# EAGLE design WMF Ambient SmartPot_A (EAGLE 9.5.1)
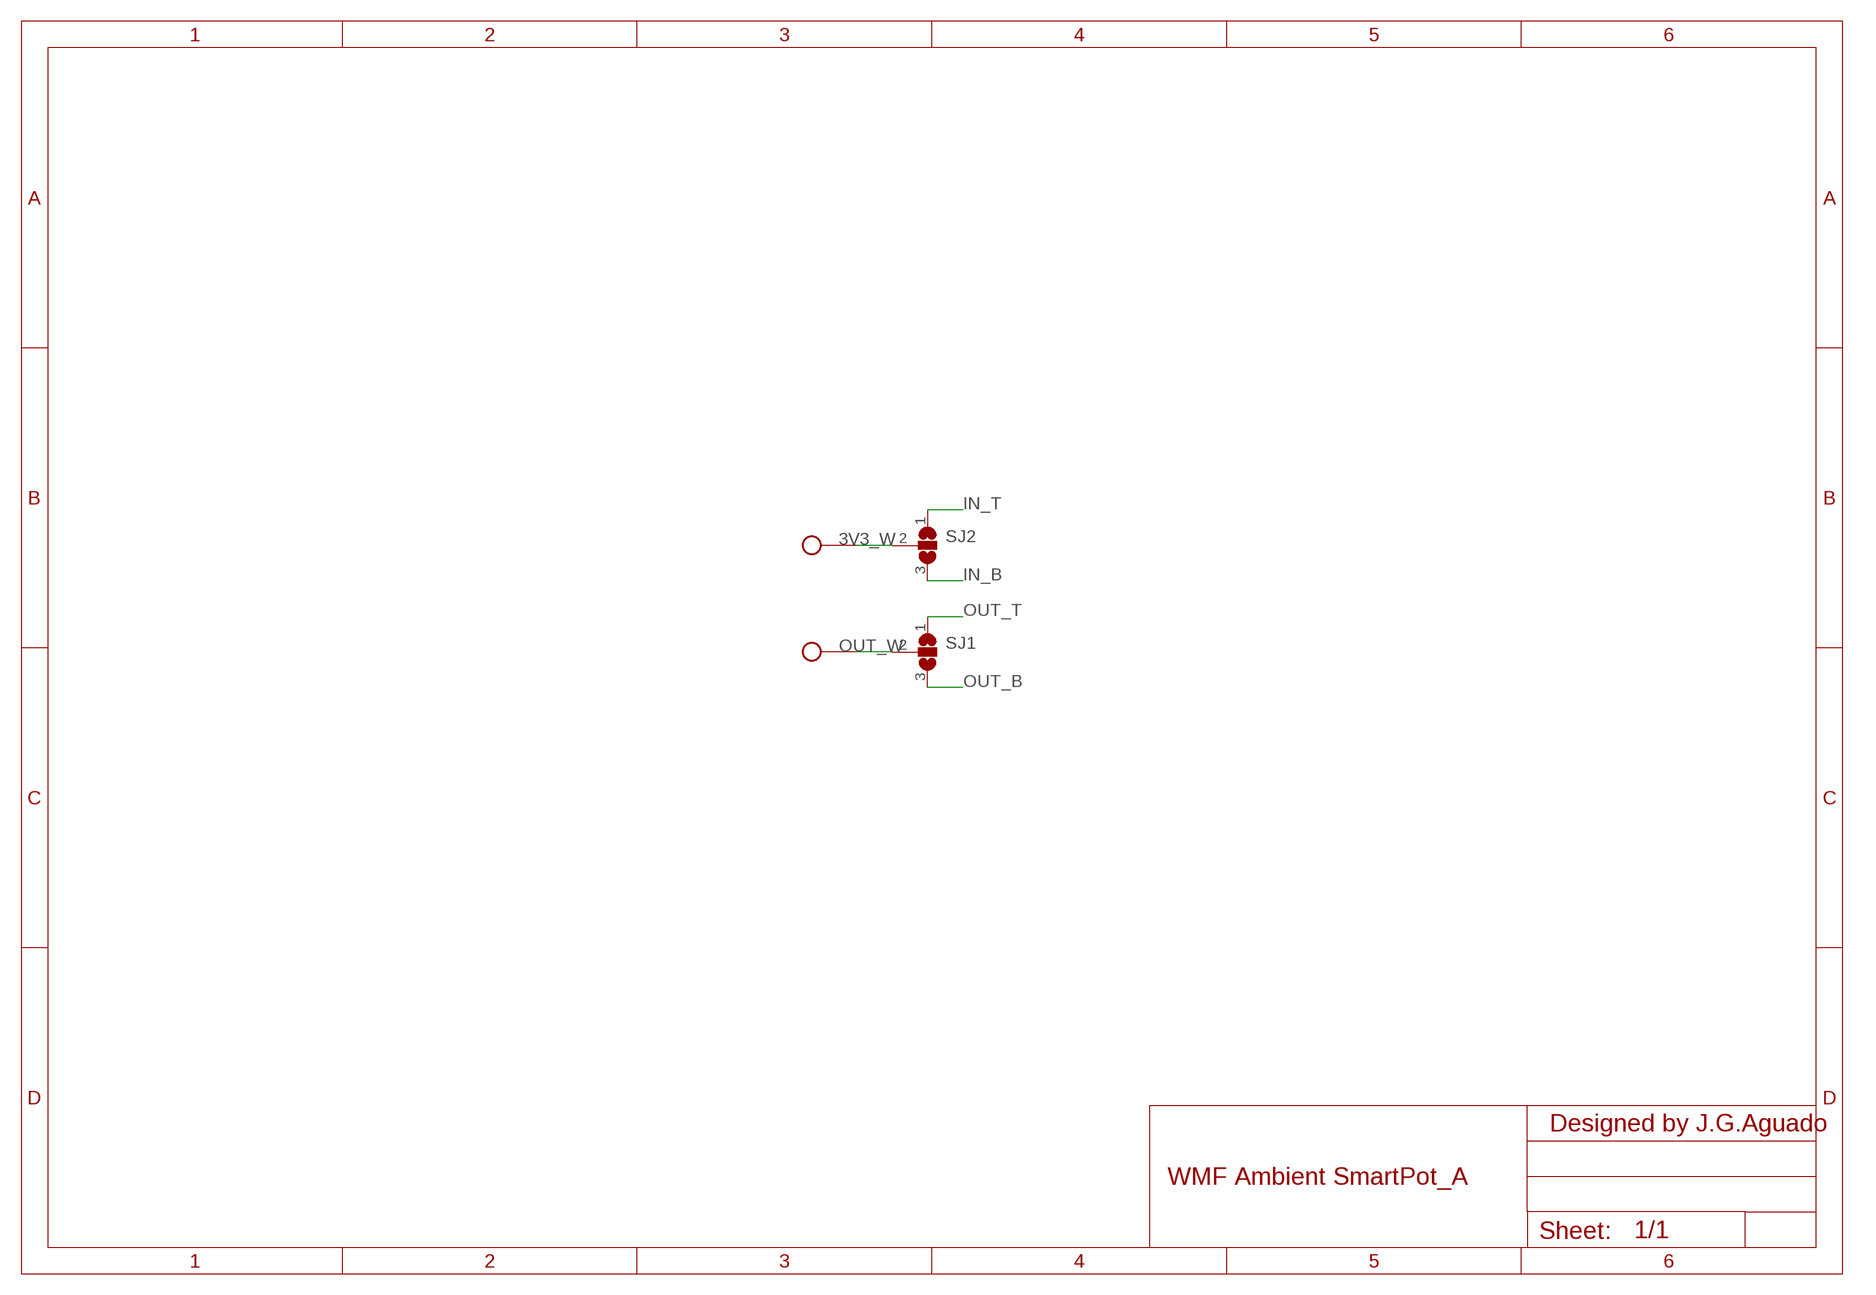
[diagram p0: schematic, sheet 1]

## Parts
SJ1  SJ2W  [SJ_2]
SJ2  SJ2W  [SJ_2]
U$4  OVAL_3MM_HOLE  [OVAL_HOLE]
U$5  OVAL_3MM_HOLE  [OVAL_HOLE]

## Nets
3V3_W: SJ2.2 U$4.P$2
IN_B: SJ2.3
IN_T: SJ2.1
OUT_B: SJ1.3
OUT_T: SJ1.1
OUT_W: SJ1.2 U$5.P$2

## Notes on the sheet
- Designed by J.G.Aguado

## Library data of the parts
SJ1 SJ2 = jumper:SJ2W: SMD solder JUMPER
U$4 U$5 = SpaceDIY_connectors:OVAL_3MM_HOLE

## Board
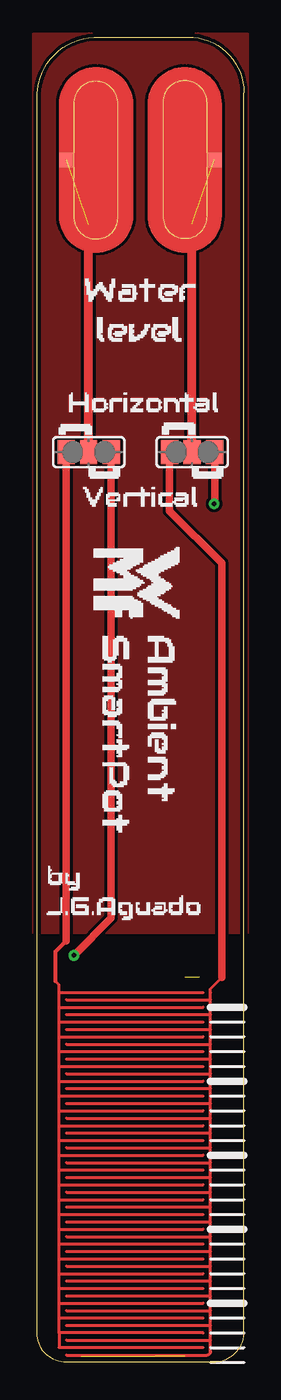
[diagram p1: board, top side]
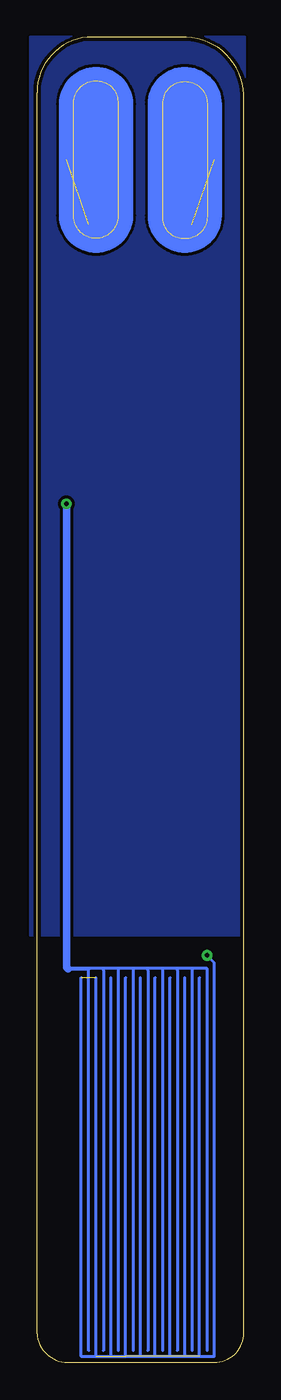
[diagram p2: board, bottom side, seen from below]

Size 14 x 89.55 mm. Coordinates in mm from the lower left corner, seen from the top.
Outline: 0,2 0,85.68 arc-90 4.25,89.55 10.25,89.55 arc-90 14,85.8 14,1.95 arc-90 11.75,0 2,0 arc-90 0,2
Copper layers (1*16): Top 0.035mm / dielectric 1.5mm / Bottom 0.035mm
Design rules "PCBway *": minimum track width 6mil, minimum drill 0.3mm, track to track 0.205mm, track to pad 0.205mm, pad to pad 0.205mm, via to via 0.205mm, smd to smd 8mil, copper to edge 10mil, drill to drill 8mil, minimum pad ring 10mil, minimum via ring 8mil, stop-mask expansion 4mil, vias tented up to drill 25mil, thermal gap 10mil

### Footprints (pad centres in the part's own frame; a part is rotated, then mirrored left to right if it is on the bottom)
SJ_2 = smd 1.168 x 1.6: 1 -1.524,0; 2 0,0; 3 1.524,0
OVAL_HOLE = smd 1 x 1: P$2 -2,0

### Placement (x,y rotation side)
SJ1  10.5,61.5 0 top
SJ2  3.5,61.5 0 top
U$4  4,81.25 0 top
U$5  10,81.25 180 top

### Tracks (layer width: path | path; a pad name or v marks a point on that pad's centre or on a via)
3V3_W  (1 unrouted)
  Top 0.61: SJ2.2 3.5,76.88
CAP
  pour Top: 11.75,0.75 arc-90 11.5,0.5
GND
  pour Top: -0.25,89.8 14.25,89.8 14.25,29 -0.25,29
  pour Bottom: 14.45,89.6 -0.05,89.6 -0.05,28.8 14.45,28.8
IN_B  (via drill 0.3)  (8 unrouted)
  Top 0.508: SJ2.3 5.02,30.03 v2.5,27.5
  Bottom 0.203: 3,0.4 3,26 | 4,0.4 4,26 | 5,0.4 5,26 | 6,0.4 6,26 | 7,0.4 7,26 | 8,0.4 8,26 | 9,0.4 9,26 | 10,0.4 10,26 | 11,26 11,0.4 2,0.4 2,27 v2.5,27.5
IN_T
  Top 0.2: 11.25,2 1.5,2 | 1.5,2 1.5,3 | 1.5,3 11.25,3 | 1.5,3 1.5,4 | 1.5,4 1.5,5 | 1.5,5 1.5,6 | 1.5,6 1.5,7 | 1.5,7 1.5,8 | 1.5,8 1.5,9 | 1.5,4 11.25,4 | 1.5,2 1.5,1 11.25,1 | 1.5,5 11.25,5 | 1.5,6 11.25,6 | 1.5,7 11.25,7 | 1.5,8 11.25,8 | 1.5,9 11.25,9 | 1.5,9 1.5,10 | 1.5,10 1.5,11 | 1.5,11 1.5,12 | 1.5,12 1.5,13 | 1.5,13 1.5,14 | 1.5,10 11.25,10 | 1.5,11 11.25,11 | 1.5,12 11.25,12 | 1.5,13 11.25,13 | 1.5,14 11.25,14 | 1.5,14 1.5,15 | 1.5,15 1.5,16 | 1.5,16 1.5,17 | 1.5,17 1.5,18 | 1.5,18 1.5,19 | 1.5,15 11.25,15 | 1.5,16 11.25,16 | 1.5,17 11.25,17 | 1.5,18 11.25,18 | 1.5,19 11.25,19 | 1.5,19 1.5,20 | 1.5,20 1.5,21 | 1.5,21 1.5,22 | 1.5,22 1.5,23 | 1.5,23 1.5,24 | 1.5,24 1.5,25 | 1.5,25 1.5,25.25 | 1.5,20 11.25,20 | 1.5,21 11.25,21 | 1.5,22 11.25,22 | 1.5,23 11.25,23 | 1.5,24 11.25,24 | 1.5,25 11.25,25
  Top 0.203: 1.5,25.25 1.5,25.5 1.24,25.77
  Top 0.254: 1.98,28.48 1.24,27.74 1.24,25.77
  Top 0.508: SJ2.1 1.98,28.48
N$19
  Bottom 0.203: 3.5,26.5 3.5,0.8
N$22
  Bottom 0.203: 4.5,26.5 4.5,0.8
N$24
  Bottom 0.203: 5.5,26.5 5.5,0.8
N$26
  Bottom 0.203: 6.5,26.5 6.5,0.8
N$28
  Bottom 0.203: 7.5,26.5 7.5,0.8
N$30
  Bottom 0.203: 8.5,26.5 8.5,0.8
N$32
  Bottom 0.203: 9.5,26.5 9.5,0.8
OUT_B  (via drill 0.3)
  Top 0.508: SJ1.3 12.02,58.03 v12,58
  Bottom 0.203: 2.5,0.8 2.5,26.62 10.5,26.62 10.5,26.6 10.5,0.8
  Bottom 0.254: 10.5,26.6 11.9,26.6
  Bottom 0.508: 11.9,26.6 12,26.7 v12,58
OUT_T
  Top 0.2: 11.75,3.5 11.75,4.5 | 11.75,4.5 11.75,5.5 | 11.75,5.5 11.75,6.5 | 11.75,6.5 11.75,7.5 | 11.75,7.5 11.75,8.5 | 11.75,8.5 11.75,9.5 | 11.75,9.5 11.75,10.5 | 2,3.5 11.75,3.5 | 2,0.5 11.5,0.5 arc90 11.75,0.75 11.75,1.5 | 2,2.5 11.75,2.5 | 11.75,2.5 11.75,3.5 | 11.75,1.5 11.75,2.5 | 2,1.5 11.75,1.5 | 2,4.5 11.75,4.5 | 2,5.5 11.75,5.5 | 2,6.5 11.75,6.5 | 2,7.5 11.75,7.5 | 2,8.5 11.75,8.5 | 2,9.5 11.75,9.5 | 11.75,10.5 11.75,11.5 | 11.75,11.5 11.75,12.5 | 11.75,12.5 11.75,13.5 | 11.75,13.5 11.75,14.5 | 11.75,14.5 11.75,15.5 | 2,10.5 11.75,10.5 | 2,11.5 11.75,11.5 | 2,12.5 11.75,12.5 | 2,13.5 11.75,13.5 | 2,14.5 11.75,14.5 | 11.75,15.5 11.75,16.5 | 11.75,16.5 11.75,17.5 | 11.75,17.5 11.75,18.5 | 11.75,18.5 11.75,19.5 | 11.75,19.5 11.75,20.5 | 2,15.5 11.75,15.5 | 2,16.5 11.75,16.5 | 2,17.5 11.75,17.5 | 2,18.5 11.75,18.5 | 2,19.5 11.75,19.5 | 11.75,20.5 11.75,21.5 | 11.75,21.5 11.75,22.5 | 11.75,22.5 11.75,23.5 | 11.75,23.5 11.75,24.5 | 11.75,24.5 11.75,25 | 2,20.5 11.75,20.5 | 2,21.5 11.75,21.5 | 2,22.5 11.75,22.5 | 2,23.5 11.75,23.5 | 2,24.5 11.75,24.5
  Top 0.203: 11.75,25 11.75,25.25 12.5,26
  Top 0.508: 12.5,26 12.5,54 8.98,57.53 SJ1.1
OUT_W  (1 unrouted)
  Top 0.61: SJ1.2 10.5,76.91